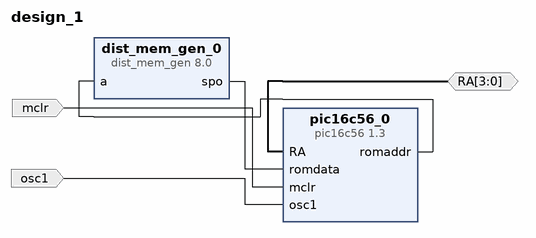
[diagram p0: block diagram of the top level]
# Vivado block design design_1, xc7z020clg400-2, Vivado 2018.2
create_bd_design design_1

create_bd_port -dir I mclr
create_bd_port -dir I osc1
create_bd_port -dir IO -from 3 -to 0 RA

create_bd_cell -type ip -vlnv xilinx.com:ip:dist_mem_gen:8.0 dist_mem_gen_0
set_property -dict [list \
  CONFIG.depth 1024 \
  CONFIG.data_width 12 \
  CONFIG.memory_type rom \
  CONFIG.coefficient_file 6.coe \
] [get_bd_cells dist_mem_gen_0]
create_bd_cell -type ip -vlnv xilinx.com:user:pic16c56:1.3 pic16c56_0

# ---- connections ----

connect_bd_net [get_bd_pins pic16c56_0/romaddr] [get_bd_pins dist_mem_gen_0/a]
connect_bd_net [get_bd_pins dist_mem_gen_0/spo] [get_bd_pins pic16c56_0/romdata]
connect_bd_net [get_bd_ports mclr] [get_bd_pins pic16c56_0/mclr]
connect_bd_net -net osc1_1 [get_bd_ports osc1] [get_bd_pins pic16c56_0/osc1]
connect_bd_net [get_bd_ports RA] [get_bd_pins pic16c56_0/RA]

validate_bd_design
save_bd_design
